# EAGLE design iot_arduino_kap8_wemos_analog_shield (EAGLE 7.1.0)
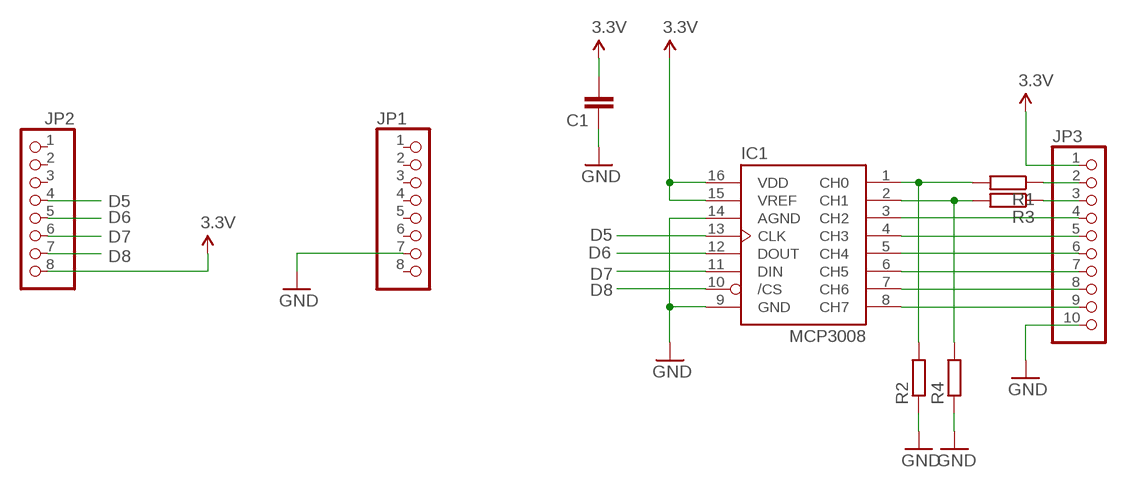
[diagram p0: schematic, sheet 1]

## Parts
C1  C-EUC0805K  [C0805K]
IC1  MCP3008  [DIL16]
JP1  PINHD-1X8  [1X08]
JP2  PINHD-1X8  [1X08]
JP3  PINHD-1X10  [1X10]
R1  R-EU_M0805  [M0805]
R2  R-EU_M0805  [M0805]
R3  R-EU_M0805  [M0805]
R4  R-EU_M0805  [M0805]

## Nets
3.3V: C1.2 IC1.15(VREF) IC1.16(VDD) JP2.8 JP3.1
D5: IC1.13(CLK) JP2.4
D6: IC1.12(DOUT) JP2.5
D7: IC1.11(DIN) JP2.6
D8: IC1.10(/CS) JP2.7
GND: C1.1 IC1.9(GND) IC1.14(AGND) JP1.7 JP3.10 R2.1 R4.1
N$1: JP3.2 R1.1
N$2: IC1.1(CH0) R1.2 R2.2
N$3: IC1.2(CH1) R3.2 R4.2
N$4: JP3.3 R3.1
N$5: IC1.3(CH2) JP3.4
N$6: IC1.4(CH3) JP3.5
N$7: IC1.5(CH4) JP3.6
N$8: IC1.6(CH5) JP3.7
N$9: IC1.7(CH6) JP3.8
N$10: IC1.8(CH7) JP3.9
Unconnected: JP1.1 JP1.2 JP1.3 JP1.4 JP1.5 JP1.6 JP1.8 JP2.1 JP2.2 JP2.3

## Library data of the parts
C1 = resistor:C-EU: CAPACITOR, European symbol
IC1 = adafruit:MCP3008
JP1 JP2 = pinhead:PINHD-1X8: PIN HEADER
JP3 = pinhead:PINHD-1X10: PIN HEADER
R1-R4 = resistor:R-EU_: RESISTOR, European symbol

## Net classes
0 default: width 0.203 mm, drill 0.356 mm, clearance 0.152 mm

## Board
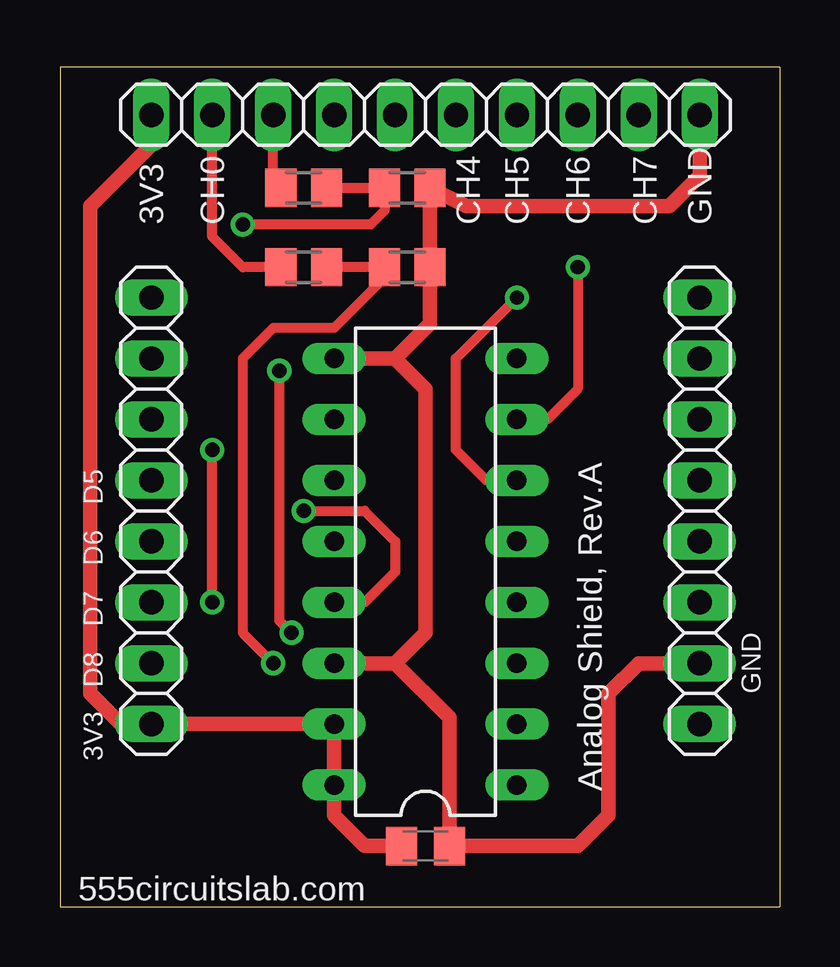
[diagram p1: board, top side]
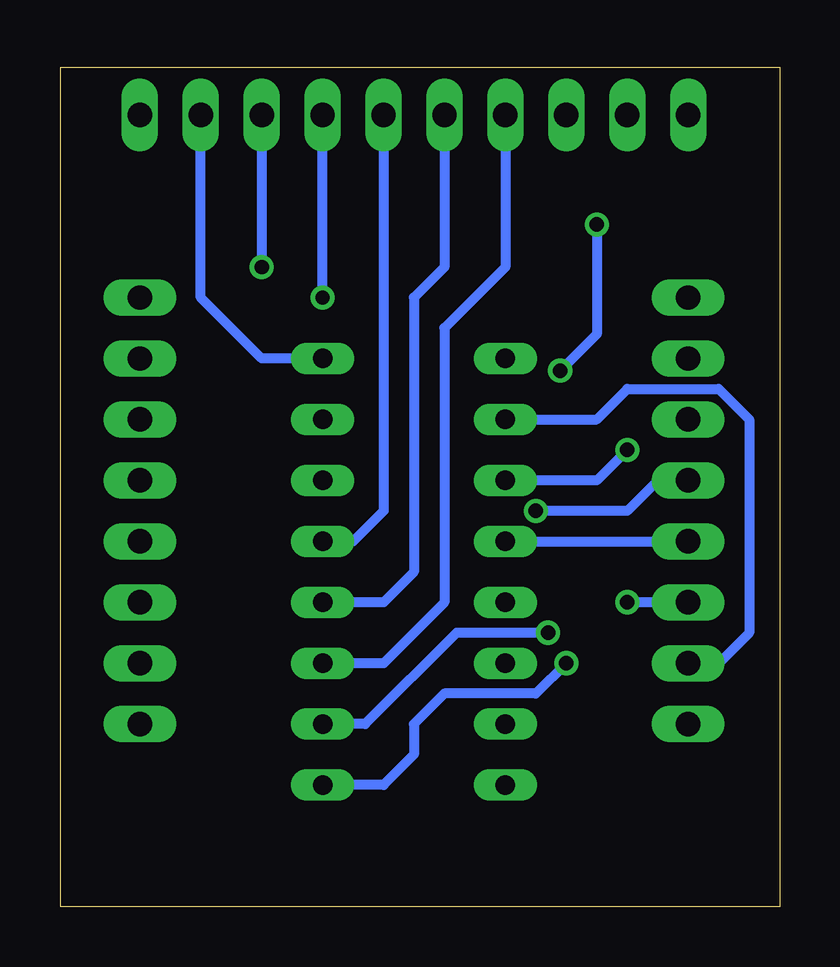
[diagram p2: board, bottom side, seen from below]

Size 30 x 35 mm. Coordinates in mm from the lower left corner, seen from the top.
Outline: 0,0 30,0 30,35 0,35 0,0
Copper layers (1*16): Top 0.035mm / dielectric 1.5mm / Bottom 0.035mm
Design rules "default": minimum track width 10mil, minimum drill 24mil, track to track 8mil, track to pad 8mil, pad to pad 8mil, via to via 8mil, smd to smd 8mil, copper to edge 40mil, drill to drill 8mil, minimum pad ring 10mil, minimum via ring 8mil, stop-mask expansion 4mil, vias tented up to drill 0mil, thermal gap 10mil

### Footprints (pad centres in the part's own frame; a part is rotated, then mirrored left to right if it is on the bottom)
C0805K = smd 1.3 x 1.6: 1 -1,0; 2 1,0
DIL16 = drill 0.813 long: 1 -8.89,-3.81; 2 -6.35,-3.81; 3 -3.81,-3.81; 4 -1.27,-3.81; 5 1.27,-3.81; 6 3.81,-3.81; 7 6.35,-3.81; 8 8.89,-3.81; 9 8.89,3.81; 10 6.35,3.81; 11 3.81,3.81; 12 1.27,3.81; 13 -1.27,3.81; 14 -3.81,3.81; 15 -6.35,3.81; 16 -8.89,3.81
1X08 = drill 1.016 long: 1 -8.89,0; 2 -6.35,0; 3 -3.81,0; 4 -1.27,0; 5 1.27,0; 6 3.81,0; 7 6.35,0; 8 8.89,0
1X10 = drill 1.016 long: 1 -11.43,0; 2 -8.89,0; 3 -6.35,0; 4 -3.81,0; 5 -1.27,0; 6 1.27,0; 7 3.81,0; 8 6.35,0; 9 8.89,0; 10 11.43,0
M0805 = smd 1.3 x 1.6: 1 -0.95,0; 2 0.95,0

### Placement (x,y rotation side)
C1  15.24,2.54 180 top
IC1  15.24,13.97 90 top
JP1  26.67,16.51 270 top
JP2  3.81,16.51 270 top
JP3  15.24,33.02 0 top
R1  10.16,26.67 0 top
R2  14.48,26.67 180 top
R3  10.16,29.97 0 top
R4  14.48,29.97 180 top

### Tracks (layer width: path | path; a pad name or v marks a point on that pad's centre or on a via)
3.3V
  Top 0.61: C1.2 12.7,2.54 11.43,3.81 IC1.16 IC1.15 JP2.8 2.54,7.62 1.27,8.89 1.27,29.21 3.81,31.75 JP3.1
D5  (via drill 0.6)
  Top 0.406: v10.16,16.51 12.7,16.51 13.97,15.24 13.97,13.97 12.7,12.7 IC1.13
  Bottom 0.406: JP2.4 5.08,17.78 6.35,16.51 v10.16,16.51
D6
  Bottom 0.406: IC1.12 JP2.5
D7  (via drill 0.6)
  Top 0.406: v6.35,12.7 v6.35,19.05
  Bottom 0.406: JP2.6 v6.35,12.7 | v6.35,19.05 7.62,17.78 IC1.11
D8
  Bottom 0.406: IC1.10 7.62,20.32 6.35,21.59 2.54,21.59 1.27,20.32 1.27,11.43 2.54,10.16 JP2.7
GND
  Top 0.61: 13.97,10.16 16.24,7.89 C1.1 21.59,2.54 22.86,3.81 22.86,8.89 24.13,10.16 JP1.7 | 13.97,10.16 IC1.14 | IC1.9 13.97,22.86 | 13.97,22.86 15.24,21.59 15.24,11.43 13.97,10.16 | JP3.10 26.67,30.48 25.4,29.21 16.95,29.21 R4.1 R2.1 15.43,24.32 13.97,22.86
N$1
  Top 0.406: R1.1 7.62,26.67 6.35,27.94 JP3.2
N$2  (via drill 0.6)
  Top 0.406: R1.2 R2.2 13.53,26.23 11.43,24.13 8.89,24.13 7.62,22.86 7.62,11.43 v8.89,10.16
  Bottom 0.406: v8.89,10.16 10.16,8.89 13.97,8.89 15.24,7.62 15.24,6.35 16.51,5.08 IC1.1
N$3  (via drill 0.6)
  Top 0.406: R3.2 R4.2 13.53,29.02 12.95,28.45 v7.62,28.45 | v9.14,22.35 9.14,11.94 v9.65,11.43
  Bottom 0.406: v7.62,28.45 7.62,23.88 v9.14,22.35 | v9.65,11.43 13.46,11.43 17.27,7.62 IC1.2
N$4
  Top 0.406: 8.89,29.78 JP3.3
  Top 0.61: 8.89,29.78 R3.1
N$5
  Bottom 0.406: JP3.4 11.43,26.67 13.97,24.13 13.97,12.7 16.51,10.16 IC1.3
N$6
  Bottom 0.406: JP3.5 13.97,26.67 15.24,25.4 15.24,13.97 16.51,12.7 IC1.4
N$7
  Bottom 0.406: JP3.6 16.51,16.51 17.78,15.24 IC1.5
N$8  (via drill 0.6)
  Top 0.406: IC1.6 17.78,17.78 16.51,19.05 16.51,22.86 v19.05,25.4
  Bottom 0.406: v19.05,25.4 JP3.7
N$9  (via drill 0.6)
  Top 0.406: v21.59,26.67 21.59,21.59 20.32,20.32 IC1.7
  Bottom 0.406: JP3.8 v21.59,26.67
N$10
  Bottom 0.406: IC1.8 21.59,22.86 24.13,25.4 JP3.9

### Text on the board
tPlace: 3V3 | CH0 | CH4 | CH5 | CH6 | CH7 | GND | D5 | D6 | D7 | D8 | GND | 3V3 | Analog Shield, Rev.A | 555circuitslab.com